# EAGLE board snowmaker_V1.0_for_eagle7.5 (EAGLE 7.7.0), part 1 of 2
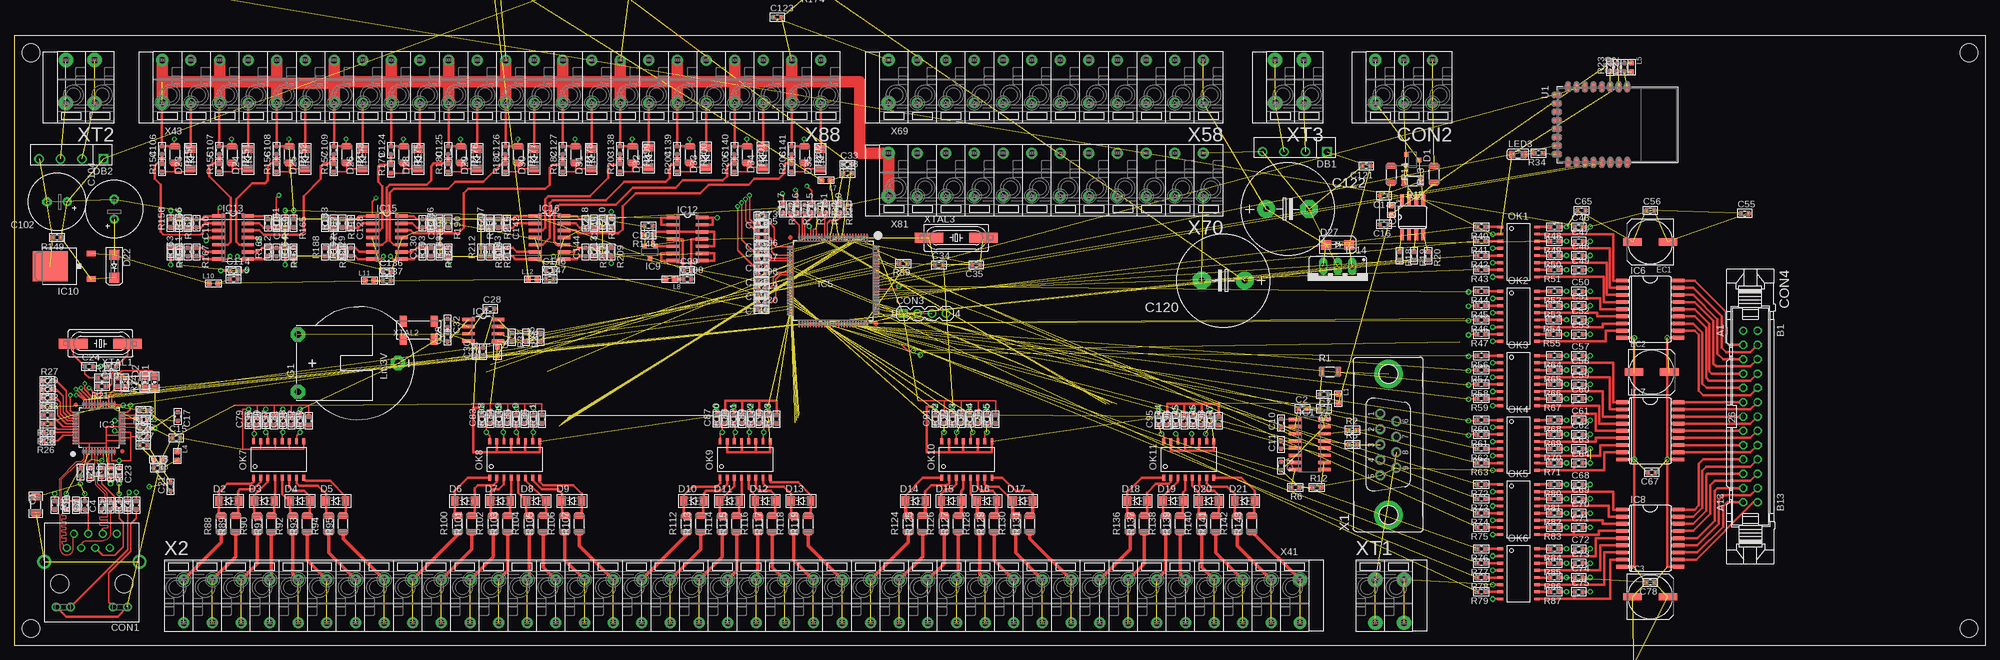
[diagram p11: board, top side]
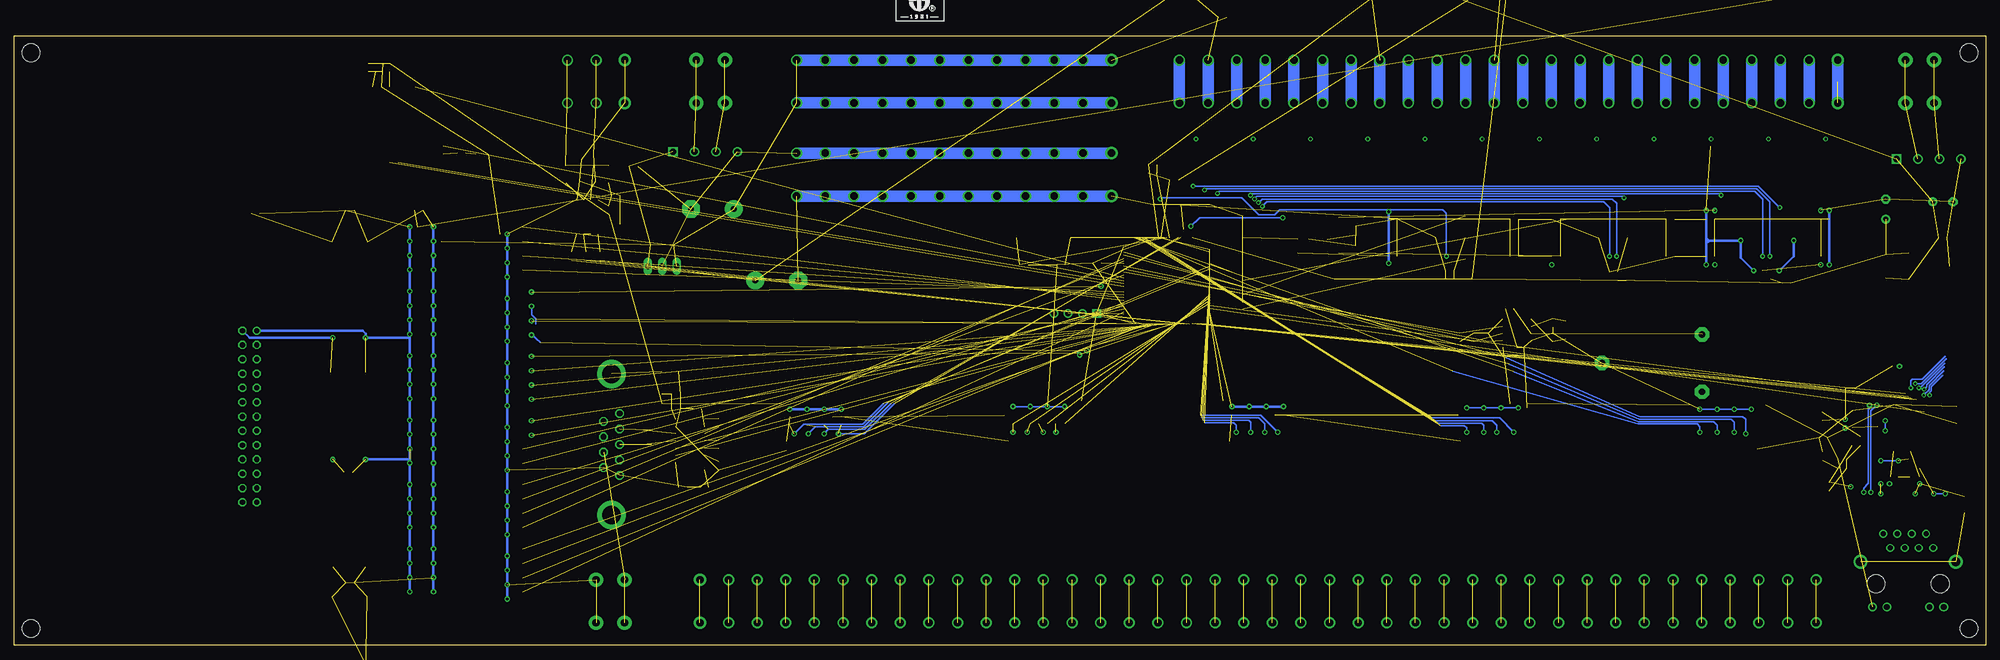
[diagram p12: board, bottom side, seen from below]

Size 350 x 108.2 mm. Coordinates in mm from the lower left corner, seen from the top.
Copper layers (1*16): Top 0.035mm / dielectric 1.5mm / Bottom 0.035mm
Design rules "default *": minimum track width 6mil, minimum drill 0.35mm, track to track 6mil, track to pad 6mil, pad to pad 6mil, via to via 6mil, smd to smd 6mil, copper to edge 40mil, drill to drill 6mil, minimum pad ring 10mil, minimum via ring 8mil, stop-mask expansion 4mil, vias tented up to drill 20mil, thermal gap 10mil

## Footprints (pad centres in the part's own frame; a part is rotated, then mirrored left to right if it is on the bottom)
C1206 = smd 1.21 x 1.82: 1 -1.45,0; 2 1.45,0
C0603 = smd 0.8 x 0.75: 1 -0.75,0; 2 0.75,0
E3,5-10 = drill 0.813 pad 1.6: + -1.778,0 | drill 0.813 pad 1.6 octagon: - 1.778,0
E7,5-16 = drill 1.016 pad 3.15: + -3.81,0 | drill 1.016 pad 3.15 octagon: - 3.81,0
TT5D11 = drill 0.813: + -2.54,0 | drill 0.813 octagon: - 2.54,0
HY951180A = drill 0.89: 1 4.445,-6.35; 2 3.175,-8.89; 3 1.905,-6.35; 4 0.635,-8.89; 5 -0.635,-6.35; 6 -1.905,-8.89; 7 -3.175,-6.35; 8 -4.445,-8.89 | drill 1.02: 9 6.325,4.11; 10 3.785,4.11; 11 -3.785,4.11; 12 -6.325,4.11 | drill 1.63: SS@1 -8.45,-3.9; SS@2 8.45,-3.9 | hole 3.2: -5.715,0; 5.715,0
FFKDS/V1-5.08-3 = drill 1.3: 1@1 0.96,2.77; 1@2 0.96,-4.85; 2@1 6.04,2.77; 2@2 6.04,-4.85 | drill 1.3 pad 2.184: 3@1 11.12,2.77; 3@2 11.12,-4.85
PINHEAD-4P = drill 1.016 square: 1 -3.81,0 | drill 1.016: 2 -1.27,0; 3 1.27,0; 4 3.81,0
26V = drill 0.914: A1 -15.24,-1.27 | drill 0.914 octagon: A2 -12.7,-1.27; A3 -10.16,-1.27; A4 -7.62,-1.27; A5 -5.08,-1.27; A6 -2.54,-1.27; A7 0,-1.27; A8 2.54,-1.27; A9 5.08,-1.27; A10 7.62,-1.27; A11 10.16,-1.27; A12 12.7,-1.27; A13 15.24,-1.27; B1 -15.24,1.27; B2 -12.7,1.27; B3 -10.16,1.27; B4 -7.62,1.27; B5 -5.08,1.27; B6 -2.54,1.27; B7 0,1.27; B8 2.54,1.27; B9 5.08,1.27; B10 7.62,1.27; B11 10.16,1.27; B12 12.7,1.27; B13 15.24,1.27
SOT23-3 = smd 0.78 x 0.78: 1 -0.95,-1.1; 2 0.95,-1.1; 3 0,1.1
MINI_MELF(LL-34) = smd 1.3 x 1.7: A 1.75,0; C -1.75,0
SMA-DO214AC = smd 1.8 x 1.7: A -2.05,0; C 2.05,0
KBP2005 = drill 1.1: AC1 -1.905,0; AC2 1.905,0; DC- 5.715,0 | drill 1.1 square: DC+ -5.715,0
UD-8X10_NICHICON = smd 3.3 x 1.3: + 3.125,0; - -3.125,0
CR2032H = drill 1.118 pad 2.54 octagon: + 5.08,10.795; +@1 -5.08,10.795; - 0,-6.985
SO16 = smd 0.6 x 2.2: 1 -4.445,-2.6; 2 -3.175,-2.6; 3 -1.905,-2.6; 4 -0.635,-2.6; 5 0.635,-2.6; 6 1.905,-2.6; 7 3.175,-2.6; 8 4.445,-2.6; 9 4.445,2.6; 10 3.175,2.6; 11 1.905,2.6; 12 0.635,2.6; 13 -0.635,2.6; 14 -1.905,2.6; 15 -3.175,2.6; 16 -4.445,2.6
SO08 = smd 0.66 x 2.032: 1 -1.905,-3.073; 2 -0.635,-3.073; 3 0.635,-3.073; 4 1.905,-3.073; 5 1.905,3.073; 6 0.635,3.073; 7 -0.635,3.073; 8 -1.905,3.073
LQFP48_7X7_0.5P = smd 0.3 x 1.26: 1 -2.75,-4.13; 2 -2.25,-4.13; 3 -1.75,-4.13; 4 -1.25,-4.13; 5 -0.75,-4.13; 6 -0.25,-4.13; 7 0.25,-4.13; 8 0.75,-4.13; 9 1.25,-4.13; 10 1.75,-4.13; 11 2.25,-4.13; 12 2.75,-4.13; 25 2.75,4.13; 26 2.25,4.13; 27 1.75,4.13; 28 1.25,4.13; 29 0.75,4.13; 30 0.25,4.13; 31 -0.25,4.13; 32 -0.75,4.13; 33 -1.25,4.13; 34 -1.75,4.13; 35 -2.25,4.13; 36 -2.75,4.13 | smd 1.26 x 0.3: 13 4.13,-2.75; 14 4.13,-2.25; 15 4.13,-1.75; 16 4.13,-1.25; 17 4.13,-0.75; 18 4.13,-0.25; 19 4.13,0.25; 20 4.13,0.75; 21 4.13,1.25; 22 4.13,1.75; 23 4.13,2.25; 24 4.13,2.75; 37 -4.13,2.75; 38 -4.13,2.25; 39 -4.13,1.75; 40 -4.13,1.25; 41 -4.13,0.75; 42 -4.13,0.25; 43 -4.13,-0.25; 44 -4.13,-0.75; 45 -4.13,-1.25; 46 -4.13,-1.75; 47 -4.13,-2.25; 48 -4.13,-2.75
SOIC-8 = smd 0.6 x 2.2: 1 -1.905,-2.6; 2 -0.635,-2.6; 3 0.635,-2.6; 4 1.905,-2.6; 5 1.905,2.6; 6 0.635,2.6; 7 -0.635,2.6; 8 -1.905,2.6
LQFP100_14X14MM = smd 0.3 x 1.26: 1 -6,-7.63; 2 -5.5,-7.63; 3 -5,-7.63; 4 -4.5,-7.63; 5 -4,-7.63; 6 -3.5,-7.63; 7 -3,-7.63; 8 -2.5,-7.63; 9 -2,-7.63; 10 -1.5,-7.63; 11 -1,-7.63; 12 -0.5,-7.63; 13 0,-7.63; 14 0.5,-7.63; 15 1,-7.63; 16 1.5,-7.63; 17 2,-7.63; 18 2.5,-7.63; 19 3,-7.63; 20 3.5,-7.63; 21 4,-7.63; 22 4.5,-7.63; 23 5,-7.63; 24 5.5,-7.63; 25 6,-7.63; 51 6,7.63; 52 5.5,7.63; 53 5,7.63; 54 4.5,7.63; 55 4,7.63; 56 3.5,7.63; 57 3,7.63; 58 2.5,7.63; 59 2,7.63; 60 1.5,7.63; 61 1,7.63; 62 0.5,7.63; 63 0,7.63; 64 -0.5,7.63; 65 -1,7.63; 66 -1.5,7.63; 67 -2,7.63; 68 -2.5,7.63; 69 -3,7.63; 70 -3.5,7.63; 71 -4,7.63; 72 -4.5,7.63; 73 -5,7.63; 74 -5.5,7.63; 75 -6,7.63 | smd 1.26 x 0.3: 26 7.63,-6; 27 7.63,-5.5; 28 7.63,-5; 29 7.63,-4.5; 30 7.63,-4; 31 7.63,-3.5; 32 7.63,-3; 33 7.63,-2.5; 34 7.63,-2; 35 7.63,-1.5; 36 7.63,-1; 37 7.63,-0.5; 38 7.63,0; 39 7.63,0.5; 40 7.63,1; 41 7.63,1.5; 42 7.63,2; 43 7.63,2.5; 44 7.63,3; 45 7.63,3.5; 46 7.63,4; 47 7.63,4.5; 48 7.63,5; 49 7.63,5.5; 50 7.63,6; 76 -7.63,6; 77 -7.63,5.5; 78 -7.63,5; 79 -7.63,4.5; 80 -7.63,4; 81 -7.63,3.5; 82 -7.63,3; 83 -7.63,2.5; 84 -7.63,2; 85 -7.63,1.5; 86 -7.63,1; 87 -7.63,0.5; 88 -7.63,0; 89 -7.63,-0.5; 90 -7.63,-1; 91 -7.63,-1.5; 92 -7.63,-2; 93 -7.63,-2.5; 94 -7.63,-3; 95 -7.63,-3.5; 96 -7.63,-4; 97 -7.63,-4.5; 98 -7.63,-5; 99 -7.63,-5.5; 100 -7.63,-6
SO18W = smd 0.66 x 2.032: 1 -5.08,-5.029; 2 -3.81,-5.029; 3 -2.54,-5.029; 4 -1.27,-5.029; 5 0,-5.029; 6 1.27,-5.029; 7 2.54,-5.029; 8 3.81,-5.029; 9 5.08,-5.029; 10 5.08,5.029; 11 3.81,5.029; 12 2.54,5.029; 13 1.27,5.029; 14 0,5.029; 15 -1.27,5.029; 16 -2.54,5.029; 17 -3.81,5.029; 18 -5.08,5.029
TO252 = smd 1 x 1.6: 1 -2.28,-4.8; 2 2.28,-4.8 | smd 5.4 x 6.2: 3 0,2.5
SOIC-14 = smd 0.6 x 2.2: 1 -3.81,-2.6; 2 -2.54,-2.6; 3 -1.27,-2.6; 4 0,-2.6; 5 1.27,-2.6; 6 2.54,-2.6; 7 3.81,-2.6; 8 3.81,2.6; 9 2.54,2.6; 10 1.27,2.6; 11 0,2.6; 12 -1.27,2.6; 13 -2.54,2.6; 14 -3.81,2.6
78XXS = drill 1.016 long: GND 0,-2.54; IN -2.54,-2.54; OUT 2.54,-2.54
L0603 = smd 0.889 x 0.889: 1 -0.762,0; 2 0.762,0
L0805 = smd 1.016 x 1.397: 1 -0.889,0; 2 0.889,0
SML0805 = smd 1.2 x 1.2: A 1.05,0; C -1.05,0
LED0805 = smd 1.15 x 1.3: A 1.125,0; C -1.125,0
MINI-FLAT-16 = smd 1 x 0.5: 1 -3.24,4.445; 2 -3.24,3.175; 3 -3.24,1.905; 4 -3.24,0.635; 5 -3.24,-0.635; 6 -3.24,-1.905; 7 -3.24,-3.175; 8 -3.24,-4.445; 9 3.24,-4.445; 10 3.24,-3.175; 11 3.24,-1.905; 12 3.24,-0.635; 13 3.24,0.635; 14 3.24,1.905; 15 3.24,3.175; 16 3.24,4.445
R1206 = smd 1.05 x 1.77: 1 -1.485,0; 2 1.485,0
R0603 = smd 0.89 x 0.96: 1 -0.755,0; 2 0.755,0
LQ-BTM2540 = smd 1.6 x 0.8: 1 -6.687,1.758; 2 -6.687,0.258; 3 -6.687,-1.242; 4 -6.687,-2.743; 5 -6.687,-4.242; 6 -6.687,-5.742; 7 -6.687,-7.242; 8 -6.687,-8.742; 17 6.713,-8.742; 18 6.713,-7.242; 19 6.713,-5.742; 20 6.713,-4.242; 21 6.713,-2.743; 22 6.713,-1.242; 23 6.713,0.258; 24 6.713,1.758 | smd 0.8 x 1.6: 9 -5.249,-10.742; 10 -3.749,-10.742; 11 -2.249,-10.742; 12 -0.749,-10.742; 13 0.751,-10.742; 14 2.251,-10.742; 15 3.751,-10.742; 16 5.251,-10.742
SNOWMAKER_V1_OUTLINE = hole 3.2: 3,3; 3,105.2; 347,105.2; 347,3
F09VP = drill 1.016 octagon: 1 5.486,1.422; 2 2.743,1.422; 3 0,1.422; 4 -2.743,1.422; 5 -5.486,1.422; 6 4.115,-1.422; 7 1.372,-1.422; 8 -1.372,-1.422; 9 -4.115,-1.422 | drill 3.302 pad 5.08: G1 -12.522,0; G2 12.522,0
FFKDS/V1-5,08-1_FIRST = drill 1.3: 1@1 0.96,2.77; 2@1 0.96,-4.85
FFKDS/V1-5,08-1_MIDDLE = drill 1.3: 1@1 0.96,2.77; 2@1 0.96,-4.85
FFKDS/V1-5,08-1_LAST = drill 1.3 pad 2.184: 1@1 0.96,2.77; 2@1 0.96,-4.85
FFKDS/V1-5.08-2 = drill 1.3 pad 2.54: 1@1 -1.58,2.77; 1@2 -1.58,-4.85; 2@1 3.5,2.77; 2@2 3.5,-4.85
SM49 = smd 5.08 x 1.778: 1 -4.826,0; 2 4.826,0
MC306 = smd 1.3 x 1.9: 1 -2.75,-1.6; 2 2.75,-1.6; 3 2.75,1.6; 4 -2.75,1.6

## Placement (x,y rotation side)
C1  1nF/2kV  [C1206]  3.86,24.97 90 top
C2  100nF/50V  [C0603]  228.69,42.02 0 top
C3  100nF/50V  [C0603]  224.88,31.86 270 top
C4  6.8nF/50V  [C0603]  15.59,24.89 90 top
C5  6.8nF/50V  [C0603]  17.11,24.89 90 top
C6  10nF/50V  [C0603]  18.63,24.89 90 top
C7  10uF/16V  [C0603]  232.5,44.56 180 top
C8  22nF/50V  [C0603]  12.54,24.89 90 top
C9  100nF/50V  [C0603]  232.5,42.02 180 top
C10  100nF/50V  [C0603]  224.88,39.48 90 top
C11  100nF/50V  [C0603]  224.88,35.67 90 top
C12  4.7uF/10V  [C0603]  22.95,38.61 0 top
C13  10nF/50V  [C0603]  22.95,40.13 0 top
C14  100nF/50V  [C0603]  243.16,79.83 180 top
C15  100nF/50V  [C0603]  28.79,36.83 0 top
C16  100nF/50V  [C0603]  243.16,74.75 180 top
C17  100nF/50V  [C0603]  29.05,40.64 270 top
C18  100nF/50V  [C0603]  25.49,31.5 0 top
C19  18pF/50V  [C0603]  17.36,49.53 180 top
C20  10uF/16V  [C0603]  284.57,102.62 90 top
C21  100nF/50V  [C0603]  27.78,28.19 90 top
C22  100nF/50V  [C0603]  285.84,102.62 90 top
C23  100nF/50V  [C0603]  18.63,30.73 270 top
C24  18pF/50V  [C0603]  13.3,49.53 0 top
C25  100nF/50V  [C0603]  11.78,30.73 270 top
C26  100nF/50V  [C0603]  22.95,37.08 0 top
C27  10uF/16V  [C0603]  22.95,35.56 0 top
C28  100nF/50V  [C0603]  84.53,59.77 0 top
C29  6.8pF/50V/NP0  [C0603]  76.91,54.69 90 top
C30  100nF/50V  [C0603]  81.99,52.15 90 top
C31  10uF/16V  [C0603]  83.26,52.15 90 top
C32  6.8pF/50V/NP0  [C0603]  76.91,57.23 270 top
C33  100nF/50V  [C0603]  147.92,85.34 0 top
C34  18pF/50V/NP0  [C0603]  164.18,67.56 0 top
C35  18pF/50V/NP0  [C0603]  170.78,67.56 180 top
C36  100nF/50V  [C0603]  76.8,124.46 0 top  (outside the outline)
C37  100nF/50V  [C0603]  69.18,124.46 0 top  (outside the outline)
C38  100nF/50V  [C0603]  61.56,124.46 0 top  (outside the outline)
C39  100nF/50V  [C0603]  53.94,124.46 0 top  (outside the outline)
C40  100nF/50V  [C0603]  46.32,124.46 0 top  (outside the outline)
C41  100nF/50V  [C0603]  38.7,124.46 0 top  (outside the outline)
C42  100nF/50V  [C0603]  31.08,124.46 0 top  (outside the outline)
C43  100nF/50V  [C0603]  23.46,124.46 0 top  (outside the outline)
C44  100nF/50V  [C0603]  18.38,123.19 0 top  (outside the outline)
C45  100nF/50V  [C0603]  17.11,118.11 0 top  (outside the outline)
C46  10nF/50V  [C0603]  277.71,74.3 0 top
C47  10nF/50V  [C0603]  277.71,71.75 0 top
C48  10nF/50V  [C0603]  277.71,69.22 0 top
C49  10nF/50V  [C0603]  277.71,66.67 0 top
C50  10nF/50V  [C0603]  277.71,62.87 0 top
C51  10nF/50V  [C0603]  277.71,60.33 0 top
C52  10nF/50V  [C0603]  277.71,57.78 0 top
C53  10nF/50V  [C0603]  277.71,55.24 0 top
C54  100nF/50V  [C0603]  300.83,-8.64 0 top  (outside the outline)
C55  100nF/50V  [C0603]  307.18,76.71 0 top
C56  100nF/50V  [C0603]  290.41,77.22 0 top
C57  10nF/50V  [C0603]  277.71,51.44 0 top
C58  10nF/50V  [C0603]  277.71,48.9 0 top
C59  10nF/50V  [C0603]  277.71,46.35 0 top
C60  10nF/50V  [C0603]  277.71,43.81 0 top
C61  10nF/50V  [C0603]  277.71,40.01 0 top
C62  10nF/50V  [C0603]  277.71,37.47 0 top
C63  10nF/50V  [C0603]  277.71,34.92 0 top
C64  10nF/50V  [C0603]  277.71,32.38 0 top
C65  100nF/50V  [C0603]  278.22,77.22 0 top
C66  100nF/50V  [C0603]  283.56,-8.64 0 top  (outside the outline)
C67  100nF/50V  [C0603]  290.67,30.73 180 top
C68  10nF/50V  [C0603]  277.71,28.57 0 top
C69  10nF/50V  [C0603]  277.71,26.04 0 top
C70  10nF/50V  [C0603]  277.71,23.5 0 top
C71  10nF/50V  [C0603]  277.71,20.95 0 top
C72  10nF/50V  [C0603]  277.71,17.14 0 top
C73  10nF/50V  [C0603]  277.71,14.61 0 top
C74  10nF/50V  [C0603]  277.71,12.06 0 top
C75  10nF/50V  [C0603]  277.71,9.53 0 top
C76  100nF/50V  [C0603]  286.86,-6.35 0 top  (outside the outline)
C77  100nF/50V  [C0603]  291.94,-9.4 0 top  (outside the outline)
C78  100nF/50V  [C0603]  290.41,11.18 180 top
C79  10nF/50V  [C0603]  41.62,39.88 90 top
C80  10nF/50V  [C0603]  44.67,39.88 90 top
C81  10nF/50V  [C0603]  47.72,39.88 90 top
C82  10nF/50V  [C0603]  50.77,39.88 90 top
C83  10nF/50V  [C0603]  83.02,40.13 90 top
C84  10nF/50V  [C0603]  86.07,40.13 90 top
C85  10nF/50V  [C0603]  89.12,40.13 90 top
C86  10nF/50V  [C0603]  92.17,40.13 90 top
C87  10nF/50V  [C0603]  124.68,40.13 90 top
C88  10nF/50V  [C0603]  127.73,40.13 90 top
C89  10nF/50V  [C0603]  130.78,40.13 90 top
C90  10nF/50V  [C0603]  133.82,40.13 90 top
C91  10nF/50V  [C0603]  163.54,40.13 90 top
C92  10nF/50V  [C0603]  166.59,40.13 90 top
C93  10nF/50V  [C0603]  169.64,40.13 90 top
C94  10nF/50V  [C0603]  172.69,40.13 90 top
C95  10nF/50V  [C0603]  203.16,39.88 90 top
C96  10nF/50V  [C0603]  206.21,39.88 90 top
C97  10nF/50V  [C0603]  209.26,39.88 90 top
C98  10nF/50V  [C0603]  212.31,39.88 90 top
C99  100nF/50V  [C0603]  119.47,66.55 0 top
C100  10uF/16V  [C0603]  119.47,65.02 0 top
C101  100nF/50V  [C0603]  112.61,74.42 180 top
C102  1000uF/16V_M10*16  [E3,5-10]  7.62,78.74 180 top
C103  100nF/50V  [C0603]  133.95,129.54 0 top  (outside the outline)
C104  220uF/16V_M10*16  [E3,5-10]  17.78,77.47 90 top
C105  100nF/50V  [C0603]  84.42,128.27 0 top  (outside the outline)
C106  100nF/50V  [C0603]  26.25,87.88 90 top
C107  100nF/50V  [C0603]  36.41,87.88 90 top
C108  100nF/50V  [C0603]  46.57,87.88 90 top
C109  100nF/50V  [C0603]  56.73,87.88 90 top
C110  30pF/50V  [C0603]  32.35,74.93 270 top
C111  30pF/50V  [C0603]  30.83,69.85 90 top
C112  30pF/50V  [C0603]  46.57,69.85 90 top
C113  30pF/50V  [C0603]  45.05,74.93 270 top
C114  100nF/50V  [C0603]  38.95,66.55 0 top
C115  1nF/50V  [C0603]  142.84,77.47 90 top
C116  1nF/50V  [C0603]  140.3,77.47 90 top
C117  1nF/50V  [C0603]  137.76,77.47 90 top
C118  1nF/50V  [C0603]  132.68,76.2 180 top
C119  10uF/16V  [C0603]  38.95,65.02 0 top
C120  2200uF/50V_M16*25  [E7,5-16]  214.63,64.77 180 top
C121  100nF/50V  [C0603]  240.03,85.09 180 top
C122  1000uF/50V_M16*25  [E7,5-16]  226.06,77.47 0 top
C123  100nF/50V  [C0603]  135.47,111.51 0 top  (outside the outline)
C124  100nF/50V  [C0603]  66.89,87.88 90 top
C125  100nF/50V  [C0603]  77.05,87.88 90 top
C126  100nF/50V  [C0603]  87.21,87.88 90 top
C127  100nF/50V  [C0603]  97.37,87.88 90 top
C128  30pF/50V  [C0603]  59.78,74.93 270 top
C129  30pF/50V  [C0603]  59.78,69.85 90 top
C130  30pF/50V  [C0603]  72.48,69.85 90 top
C131  30pF/50V  [C0603]  72.48,74.93 270 top
C132  1nF/50V  [C0603]  132.68,72.39 180 top
C133  1nF/50V  [C0603]  132.68,71.12 180 top
C134  1nF/50V  [C0603]  132.68,68.58 180 top
C135  1nF/50V  [C0603]  132.68,66.04 180 top
C136  100nF/50V  [C0603]  66.13,66.29 0 top
C137  10uF/16V  [C0603]  66.13,64.77 0 top
C138  100nF/50V  [C0603]  107.53,87.88 90 top
C139  100nF/50V  [C0603]  117.69,87.88 90 top
C140  100nF/50V  [C0603]  127.85,87.88 90 top
C141  100nF/50V  [C0603]  138.01,87.88 90 top
C142  30pF/50V  [C0603]  87.47,74.93 270 top
C143  30pF/50V  [C0603]  87.47,69.85 90 top
C144  30pF/50V  [C0603]  101.44,69.85 90 top
C145  30pF/50V  [C0603]  101.44,74.93 270 top
C146  100nF/50V  [C0603]  95.09,66.55 0 top
C147  10uF/16V  [C0603]  95.09,65.02 0 top
C148  1nF/50V  [C0603]  132.68,63.5 180 top
C149  1nF/50V  [C0603]  132.68,60.96 180 top
C150  1nF/50V  [C0603]  147.92,77.47 90 top
C151  1nF/50V  [C0603]  145.38,77.47 90 top
C152  [TT5D11]  156.21,120.65 0 top  (outside the outline)
C153  [TT5D11]  173.99,121.92 0 top  (outside the outline)
CON1  HR951180A  [HY951180A]  13.8,10.95 180 top
CON2  FFKDS/V1-5.08-3  [FFKDS/V1-5.08-3]  252.73,99.06 180 top
CON3  SWJ  [PINHEAD-4P]  161.64,58.93 0 top
CON4  [26V]  308.19,40.64 270 top
D1  SM712-02H  [SOT23-3]  248.24,86.18 270 top
D2  1N4148  [MINI_MELF(LL-34)]  38.06,25.65 0 top
D3  1N4148  [MINI_MELF(LL-34)]  44.41,25.65 0 top
D4  1N4148  [MINI_MELF(LL-34)]  50.77,25.65 0 top
D5  1N4148  [MINI_MELF(LL-34)]  57.12,25.65 0 top
D6  1N4148  [MINI_MELF(LL-34)]  79.97,25.65 0 top
D7  1N4148  [MINI_MELF(LL-34)]  86.33,25.65 0 top
D8  1N4148  [MINI_MELF(LL-34)]  92.67,25.65 0 top
D9  1N4148  [MINI_MELF(LL-34)]  99.03,25.65 0 top
D10  1N4148  [MINI_MELF(LL-34)]  120.61,25.65 0 top
D11  1N4148  [MINI_MELF(LL-34)]  126.97,25.65 0 top
D12  1N4148  [MINI_MELF(LL-34)]  133.31,25.65 0 top
D13  1N4148  [MINI_MELF(LL-34)]  139.66,25.65 0 top
D14  1N4148  [MINI_MELF(LL-34)]  159.99,25.65 0 top
D15  1N4148  [MINI_MELF(LL-34)]  166.34,25.65 0 top
D16  1N4148  [MINI_MELF(LL-34)]  172.69,25.65 0 top
D17  1N4148  [MINI_MELF(LL-34)]  179.03,25.65 0 top
D18  1N4148  [MINI_MELF(LL-34)]  199.35,25.65 0 top
D19  1N4148  [MINI_MELF(LL-34)]  205.71,25.65 0 top
D20  1N4148  [MINI_MELF(LL-34)]  212.06,25.65 0 top
D21  1N4148  [MINI_MELF(LL-34)]  218.41,25.65 0 top
D22  1N4007  [SMA-DO214AC]  17.78,67.31 270 top
D23  1N4148  [MINI_MELF(LL-34)]  31.33,86.36 90 top
D24  1N4148  [MINI_MELF(LL-34)]  41.49,86.36 90 top
D25  1N4148  [MINI_MELF(LL-34)]  51.65,86.36 90 top
D26  1N4148  [MINI_MELF(LL-34)]  61.81,86.36 90 top
D27  1N4007  [SMA-DO214AC]  234.95,71.12 0 top
D28  1N4148  [MINI_MELF(LL-34)]  71.72,86.36 90 top
D29  1N4148  [MINI_MELF(LL-34)]  82.13,86.36 90 top
D30  1N4148  [MINI_MELF(LL-34)]  92.29,86.36 90 top
D31  1N4148  [MINI_MELF(LL-34)]  102.45,86.36 90 top
D32  1N4148  [MINI_MELF(LL-34)]  112.61,86.61 90 top
D33  1N4148  [MINI_MELF(LL-34)]  122.77,86.61 90 top
D34  1N4148  [MINI_MELF(LL-34)]  132.93,86.61 90 top
D35  1N4148  [MINI_MELF(LL-34)]  143.09,86.36 90 top
DB1  KBP2005G  [KBP2005]  227.33,87.63 180 top
DB2  KBP2005G  [KBP2005]  10.16,86.36 180 top
EC1  220uF/50V  [UD-8X10_NICHICON]  290.41,71.63 180 top
EC2  220uF/50V  [UD-8X10_NICHICON]  290.67,48.51 0 top
EC3  220uF/50V  [UD-8X10_NICHICON]  290.41,8.64 0 top
G1  CR2032H  [CR2032H]  61.16,50.12 90 top
IC1  ST3232BD  [SO16]  229.97,35.67 270 top
IC2  ST3485EBD  [SO08]  248.24,76.02 0 top
IC3  W5500  [LQFP48_7X7_0.5P]  15.08,38.61 0 top
IC4  SD2068  [SOIC-8]  83.26,55.96 270 top
IC5  STM32F103VCT6  [LQFP100_14X14MM]  145.38,64.77 180 top
IC6  ULN2803  [SO18W]  290.41,59.69 270 top
IC7  ULN2803  [SO18W]  290.41,38.1 270 top
IC8  ULN2803  [SO18W]  290.41,19.05 270 top
IC9  LM4040AIM3X-2.5  [SOT23-3]  112.87,69.85 180 top
IC10  LM1117IDTX-3.3  [TO252]  8.89,67.31 90 top
IC12  SGM8584XS14  [SOIC-14]  119.54,72.14 270 top
IC13  SGM8584XS14  [SOIC-14]  38.87,72.39 270 top
IC14  LM78M24  [78XXS]  234.95,64.77 180 top
IC15  SGM8584XS14  [SOIC-14]  66.18,72.39 270 top
IC16  SGM8584XS14  [SOIC-14]  95.02,72.39 270 top
L1  600R/100MHz  [L0603]  235.04,43.8 270 top
L2  600R/100MHz  [L0603]  244.43,77.29 270 top
L3  120R/100MHz 3A  [L0603]  25.49,33.02 180 top
L4  120R/100MHz 3A  [L0603]  28.96,33.62 270 top
L5  600R/100MHz  [L0603]  287.11,102.62 270 top
L6  600R/100MHz  [L0603]  85.8,52.15 270 top
L7  600R/100MHz  [L0603]  144.11,82.55 180 top
L8  10uH  [L0603]  116.42,65.02 180 top
L9  120R/100MHz 3A  [L0805]  108.33,116.25 0 top  (outside the outline)
L10  10uH  [L0603]  35.4,64.26 0 top
L11  10uH  [L0603]  63.08,64.77 0 top
L12  10uH  [L0603]  92.04,65.02 0 top
LED1  [SML0805]  24.94,46.7 90 top
LED2  [SML0805]  23.16,46.7 90 top
LED3  [LED0805]  266.94,87.17 0 top
LOGO1  SY-LOGO_BOTTOM  [SY-LOGO_BOTTOM]  189.19,114.3 0 top  (outside the outline)
OK1  TLP283-4  [MINI-FLAT-16]  267.05,69.85 0 top
OK2  TLP283-4  [MINI-FLAT-16]  267.05,58.42 0 top
OK3  TLP283-4  [MINI-FLAT-16]  267.05,46.99 0 top
OK4  TLP283-4  [MINI-FLAT-16]  267.05,35.56 0 top
OK5  TLP283-4  [MINI-FLAT-16]  267.05,24.13 0 top
OK6  TLP283-4  [MINI-FLAT-16]  267.05,12.7 0 top
OK7  TLP283-4  [MINI-FLAT-16]  46.95,33.02 90 top
OK8  TLP283-4  [MINI-FLAT-16]  88.86,33.02 90 top
OK9  TLP283-4  [MINI-FLAT-16]  129.76,33.02 90 top
OK10  TLP283-4  [MINI-FLAT-16]  169.13,33.02 90 top
OK11  TLP283-4  [MINI-FLAT-16]  208.5,33.02 90 top
R1  0R  [R1206]  233.56,48.6 0 top
R2  22R  [R0603]  237.59,38.21 0 top
R3  330R  [R0603]  20.16,24.89 90 top
R4  330R  [R0603]  21.68,24.89 90 top
R5  22R  [R0603]  237.59,35.67 0 top
R6  10k  [R0603]  227.43,28.05 180 top
R7  49R9  [R0603]  9.24,24.89 270 top
R8  49R9  [R0603]  7.2,24.89 270 top
R9  49R9  [R0603]  13.55,30.73 270 top
R10  10R  [R0603]  11.01,24.89 90 top
R11  49R9  [R0603]  15.59,30.73 270 top
R12  10k  [R0603]  231.24,28.05 0 top
R13  120R  [R1206]  252.05,83.64 90 top
R14  2.4k  [R1206]  244.43,83.64 270 top
R15  2.4k  [R1206]  248.24,82.37 180 top
R16  12.4k/1%  [R0603]  17.11,30.73 270 top
R17  10k  [R0603]  22.95,41.66 180 top
R18  0R  [R0603]  245.93,69.16 270 top
R19  0R  [R0603]  248.47,69.16 270 top
R20  0R  [R0603]  251.01,69.16 270 top
R21  1M  [R0603]  15.59,45.97 180 top
R22  0R  [R0603]  15.59,47.5 0 top
R23  10k  [R0603]  283.3,102.62 90 top
R24  330R  [R0603]  19.65,46.74 270 top
R25  330R  [R0603]  18.38,46.74 270 top
R26  10k  [R0603]  5.93,36.32 180 top
R27  10k  [R0603]  5.93,46.99 0 top
R28  10k  [R0603]  5.93,37.85 180 top
R29  10k  [R0603]  5.93,45.47 0 top
R30  10k  [R0603]  5.93,39.37 180 top
R31  10k  [R0603]  5.93,43.94 0 top
R32  10k  [R0603]  5.93,42.42 0 top
R33  10k  [R0603]  5.93,40.89 0 top
R34  1k  [R0603]  270.6,87.38 180 top
R35  10k  [R0603]  93.42,54.69 90 top
R36  10k  [R0603]  90.88,54.69 270 top
R37  10k  [R0603]  88.34,54.69 270 top
R38  10k  [R0603]  147.92,83.82 0 top
R39  10k  [R0603]  157.83,67.82 180 top
R40  330R  [R0603]  260.44,74.3 180 top
R41  330R  [R0603]  260.44,71.75 180 top
R42  330R  [R0603]  260.44,69.22 180 top
R43  330R  [R0603]  260.44,66.67 180 top
R44  330R  [R0603]  260.44,62.87 180 top
R45  330R  [R0603]  260.44,60.33 180 top
R46  330R  [R0603]  260.44,57.78 180 top
R47  330R  [R0603]  260.44,55.24 180 top
R48  20K  [R0603]  273.4,74.3 180 top
R49  20K  [R0603]  273.4,71.75 180 top
R50  20K  [R0603]  273.4,69.22 180 top
R51  20K  [R0603]  273.4,66.67 180 top
R52  20K  [R0603]  273.4,62.87 180 top
R53  20K  [R0603]  273.4,60.33 180 top
R54  20K  [R0603]  273.27,57.78 180 top
R55  20K  [R0603]  273.27,55.24 180 top
R56  330R  [R0603]  260.44,51.44 180 top
R57  330R  [R0603]  260.44,48.9 180 top
R58  330R  [R0603]  260.44,46.35 180 top
R59  330R  [R0603]  260.44,43.81 180 top
R60  330R  [R0603]  260.44,40.01 180 top
R61  330R  [R0603]  260.44,37.47 180 top
R62  330R  [R0603]  260.44,34.92 180 top
R63  330R  [R0603]  260.44,32.38 180 top
R64  20K  [R0603]  273.4,51.44 180 top
R65  20K  [R0603]  273.4,48.9 180 top
R66  20K  [R0603]  273.4,46.35 180 top
R67  20K  [R0603]  273.4,43.81 180 top
R68  20K  [R0603]  273.4,40.01 180 top
R69  20K  [R0603]  273.4,37.47 180 top
R70  20K  [R0603]  273.4,34.92 180 top
R71  20K  [R0603]  273.4,32.38 180 top
R72  330R  [R0603]  260.44,28.57 180 top
R73  330R  [R0603]  260.44,26.04 180 top
R74  330R  [R0603]  260.44,23.5 180 top
R75  330R  [R0603]  260.44,20.95 180 top
R76  330R  [R0603]  260.44,17.14 180 top
R77  330R  [R0603]  260.44,14.61 180 top
R78  330R  [R0603]  260.44,12.06 180 top
R79  330R  [R0603]  260.44,9.53 180 top
R80  20K  [R0603]  273.4,28.57 180 top
R81  20K  [R0603]  273.4,26.04 180 top
R82  20K  [R0603]  273.4,23.5 180 top
R83  20K  [R0603]  273.4,20.95 180 top
R84  20K  [R0603]  273.4,17.14 180 top
R85  20K  [R0603]  273.4,14.61 180 top
R86  20K  [R0603]  273.4,12.06 180 top
R87  20K  [R0603]  273.4,9.53 180 top
R88  2.2k  [R1206]  36.8,21.59 90 top
R89  2.2k  [R1206]  39.34,21.59 90 top
R90  2.2k  [R1206]  43.15,21.59 90 top
R91  2.2k  [R1206]  45.69,21.59 90 top
R92  2.2k  [R1206]  49.49,21.59 90 top
R93  2.2k  [R1206]  52.03,21.59 90 top
R94  2.2k  [R1206]  55.84,21.59 90 top
R95  2.2k  [R1206]  58.38,21.59 90 top
R96  10K  [R0603]  43.15,39.88 90 top
R97  10K  [R0603]  46.19,39.88 90 top
R98  10K  [R0603]  49.24,39.88 90 top
R99  10K  [R0603]  52.29,39.88 90 top
R100  2.2k  [R1206]  78.7,21.59 90 top
R101  2.2k  [R1206]  81.25,21.59 90 top
R102  2.2k  [R1206]  85.06,21.59 90 top
R103  2.2k  [R1206]  87.59,21.59 90 top
R104  2.2k  [R1206]  91.41,21.59 90 top
R105  2.2k  [R1206]  93.94,21.59 90 top
R106  2.2k  [R1206]  97.75,21.59 90 top
R107  2.2k  [R1206]  100.3,21.59 90 top
R108  10K  [R0603]  84.55,40.13 90 top
R109  10K  [R0603]  87.59,40.13 90 top
R110  10K  [R0603]  90.64,40.13 90 top
R111  10K  [R0603]  93.69,40.13 90 top
R112  2.2k  [R1206]  119.34,21.59 90 top
R113  2.2k  [R1206]  121.89,21.59 90 top
R114  2.2k  [R1206]  125.69,21.59 90 top
R115  2.2k  [R1206]  128.24,21.59 90 top
R116  2.2k  [R1206]  132.04,21.59 90 top
R117  2.2k  [R1206]  134.59,21.59 90 top
R118  2.2k  [R1206]  138.4,21.59 90 top
R119  2.2k  [R1206]  140.94,21.59 90 top
R120  10K  [R0603]  126.2,40.13 90 top
R121  10K  [R0603]  129.25,40.13 90 top
R122  10K  [R0603]  132.3,40.13 90 top
R123  10K  [R0603]  135.35,40.13 90 top
R124  2.2k  [R1206]  158.72,21.59 90 top
R125  2.2k  [R1206]  161.25,21.59 90 top
R126  2.2k  [R1206]  165.06,21.59 90 top
R127  2.2k  [R1206]  167.6,21.59 90 top
R128  2.2k  [R1206]  171.41,21.59 90 top
R129  2.2k  [R1206]  173.96,21.59 90 top
R130  2.2k  [R1206]  177.76,21.59 90 top
R131  2.2k  [R1206]  180.31,21.59 90 top
R132  10K  [R0603]  165.06,40.13 90 top
R133  10K  [R0603]  168.11,40.13 90 top
R134  10K  [R0603]  171.16,40.13 90 top
R135  10K  [R0603]  174.21,40.13 90 top
R136  2.2k  [R1206]  198.09,21.59 90 top
R137  2.2k  [R1206]  200.62,21.59 90 top
R138  2.2k  [R1206]  204.44,21.59 90 top
R139  2.2k  [R1206]  206.97,21.59 90 top
R140  2.2k  [R1206]  210.78,21.59 90 top
R141  2.2k  [R1206]  213.32,21.59 90 top
R142  2.2k  [R1206]  217.13,21.59 90 top
R143  2.2k  [R1206]  219.68,21.59 90 top
R144  10K  [R0603]  204.69,39.88 90 top
R145  10K  [R0603]  207.74,39.88 90 top
R146  10K  [R0603]  210.78,39.88 90 top
R147  10K  [R0603]  213.83,39.88 90 top
R148  10k  [R0603]  112.61,72.9 180 top
R149  10K  [R0603]  7.62,72.39 180 top
R150  120R/0.1%  [R1206]  28.54,87.12 270 top
R151  120R/0.1%  [R1206]  38.7,87.12 270 top
R152  120R/0.1%  [R1206]  48.86,87.12 270 top
R153  120R/0.1%  [R1206]  59.02,87.12 270 top
R154  10k  [R0603]  26.25,84.84 90 top
R155  10k  [R0603]  36.41,84.84 90 top
R156  10k  [R0603]  46.57,84.84 90 top
R157  10k  [R0603]  56.73,84.84 90 top
R158  5.11k/1%  [R0603]  27.78,74.93 90 top
R159  5.11k/1%  [R0603]  27.78,69.85 270 top
R160  5.11k/1%  [R0603]  48.1,69.85 270 top
R161  5.11k/1%  [R0603]  48.1,74.93 90 top
R162  124k/1%  [R0603]  29.3,74.93 270 top
R163  124k/1%  [R0603]  29.3,69.85 90 top
R164  124k/1%  [R0603]  49.62,69.85 90 top
R165  124k/1%  [R0603]  49.62,74.93 270 top
R166  1k/1%  [R0603]  30.83,74.93 90 top
R167  1k/1%  [R0603]  32.35,69.85 270 top
R168  1k/1%  [R0603]  45.05,69.85 90 top
R169  1k/1%  [R0603]  46.57,74.93 270 top
R170  1k  [R0603]  141.57,77.47 270 top
R171  1k  [R0603]  139.03,77.47 270 top
R172  1k  [R0603]  136.49,77.47 270 top
R173  1k  [R0603]  132.68,74.93 0 top
R174  20K  [R0603]  142.59,116.33 180 top  (outside the outline)
R175  120R/0.1%  [R1206]  69.18,87.12 270 top
R176  120R/0.1%  [R1206]  79.34,87.12 270 top
R177  120R/0.1%  [R1206]  89.5,87.12 270 top
R178  120R/0.1%  [R1206]  99.66,87.12 270 top
R179  10k  [R0603]  66.89,84.58 90 top
R180  10k  [R0603]  77.05,84.84 90 top
R181  10k  [R0603]  87.21,84.84 90 top
R182  10k  [R0603]  97.37,84.84 90 top
R183  5.11k/1%  [R0603]  56.73,74.93 90 top
R184  5.11k/1%  [R0603]  56.73,69.85 270 top
R185  5.11k/1%  [R0603]  75.53,69.85 270 top
R186  5.11k/1%  [R0603]  75.53,74.93 90 top
R187  124k/1%  [R0603]  55.21,74.93 270 top
R188  124k/1%  [R0603]  55.21,69.85 90 top
R189  124k/1%  [R0603]  77.05,69.85 90 top
R190  124k/1%  [R0603]  77.05,74.93 270 top
R191  1k/1%  [R0603]  58.26,74.93 270 top
R192  1k/1%  [R0603]  58.26,69.85 90 top
R193  1k/1%  [R0603]  74.01,69.85 90 top
R194  1k/1%  [R0603]  74.01,74.93 270 top
R195  1k  [R0603]  132.68,73.66 0 top
R196  1k  [R0603]  132.68,69.85 0 top
R197  1k  [R0603]  132.68,67.31 0 top
R198  1k  [R0603]  132.68,64.77 0 top
R199  120R/0.1%  [R1206]  109.82,87.12 270 top
R200  120R/0.1%  [R1206]  119.98,87.12 270 top
R201  120R/0.1%  [R1206]  130.14,87.12 270 top
R202  120R/0.1%  [R1206]  140.3,87.12 270 top
R203  10k  [R0603]  107.53,84.84 90 top
R204  10k  [R0603]  117.69,84.84 90 top
R205  10k  [R0603]  127.85,84.84 90 top
R206  10k  [R0603]  138.01,84.84 90 top
R207  5.11k/1%  [R0603]  84.42,74.93 90 top
R208  5.11k/1%  [R0603]  84.42,69.85 270 top
R209  5.11k/1%  [R0603]  106.01,69.85 270 top
R210  5.11k/1%  [R0603]  106.01,74.93 90 top
R211  124k/1%  [R0603]  82.9,74.93 270 top
R212  124k/1%  [R0603]  82.9,69.85 90 top
R213  124k/1%  [R0603]  104.49,69.85 90 top
R214  124k/1%  [R0603]  104.49,74.93 270 top
R215  1k/1%  [R0603]  85.94,74.93 270 top
R216  1k/1%  [R0603]  85.94,69.85 270 top
R217  1k/1%  [R0603]  102.96,69.85 270 top
R218  1k/1%  [R0603]  102.96,74.93 90 top
R219  1k  [R0603]  132.68,62.23 0 top
R220  1k  [R0603]  132.68,59.69 0 top
R221  1k  [R0603]  146.65,77.47 270 top
R222  1k  [R0603]  144.11,77.47 270 top
U1  LQ-BTM2540  [LQ-BTM2540]  284.57,92.46 270 top
U$1  [SNOWMAKER_V1_OUTLINE]  0,0 0 top
X1  [F09VP]  243.94,35.67 90 top
X2  FFKDS/V1-5.08_FIRST  [FFKDS/V1-5,08-1_FIRST]  29.18,8.89 0 top
X3  FFKDS/V1-5.08_MIDDLE  [FFKDS/V1-5,08-1_MIDDLE]  34.26,8.89 0 top
X4  FFKDS/V1-5.08_MIDDLE  [FFKDS/V1-5,08-1_MIDDLE]  39.34,8.89 0 top
X5  FFKDS/V1-5.08_MIDDLE  [FFKDS/V1-5,08-1_MIDDLE]  44.41,8.89 0 top
X6  FFKDS/V1-5.08_MIDDLE  [FFKDS/V1-5,08-1_MIDDLE]  49.49,8.89 0 top
X7  FFKDS/V1-5.08_MIDDLE  [FFKDS/V1-5,08-1_MIDDLE]  54.58,8.89 0 top
X8  FFKDS/V1-5.08_MIDDLE  [FFKDS/V1-5,08-1_MIDDLE]  59.66,8.89 0 top
X9  FFKDS/V1-5.08_MIDDLE  [FFKDS/V1-5,08-1_MIDDLE]  64.73,8.89 0 top
X10  FFKDS/V1-5.08_MIDDLE  [FFKDS/V1-5,08-1_MIDDLE]  69.81,8.89 0 top
X11  FFKDS/V1-5.08_MIDDLE  [FFKDS/V1-5,08-1_MIDDLE]  74.89,8.89 0 top
X12  FFKDS/V1-5.08_MIDDLE  [FFKDS/V1-5,08-1_MIDDLE]  79.97,8.89 0 top
X13  FFKDS/V1-5.08_MIDDLE  [FFKDS/V1-5,08-1_MIDDLE]  85.06,8.89 0 top
X14  FFKDS/V1-5.08_MIDDLE  [FFKDS/V1-5,08-1_MIDDLE]  90.14,8.89 0 top
X15  FFKDS/V1-5.08_MIDDLE  [FFKDS/V1-5,08-1_MIDDLE]  95.22,8.89 0 top
X16  FFKDS/V1-5.08_MIDDLE  [FFKDS/V1-5,08-1_MIDDLE]  100.3,8.89 0 top
X17  FFKDS/V1-5.08_MIDDLE  [FFKDS/V1-5,08-1_MIDDLE]  105.38,8.89 0 top
X18  FFKDS/V1-5.08_MIDDLE  [FFKDS/V1-5,08-1_MIDDLE]  110.45,8.89 0 top
X19  FFKDS/V1-5.08_MIDDLE  [FFKDS/V1-5,08-1_MIDDLE]  115.53,8.89 0 top
X20  FFKDS/V1-5.08_MIDDLE  [FFKDS/V1-5,08-1_MIDDLE]  120.61,8.89 0 top
X21  FFKDS/V1-5.08_MIDDLE  [FFKDS/V1-5,08-1_MIDDLE]  125.69,8.89 0 top
X22  FFKDS/V1-5.08_MIDDLE  [FFKDS/V1-5,08-1_MIDDLE]  130.78,8.89 0 top
X23  FFKDS/V1-5.08_MIDDLE  [FFKDS/V1-5,08-1_MIDDLE]  135.85,8.89 0 top
X24  FFKDS/V1-5.08_MIDDLE  [FFKDS/V1-5,08-1_MIDDLE]  140.94,8.89 0 top
X25  FFKDS/V1-5.08_MIDDLE  [FFKDS/V1-5,08-1_MIDDLE]  146.01,8.89 0 top
X26  FFKDS/V1-5.08_MIDDLE  [FFKDS/V1-5,08-1_MIDDLE]  151.09,8.89 0 top
X27  FFKDS/V1-5.08_MIDDLE  [FFKDS/V1-5,08-1_MIDDLE]  156.18,8.89 0 top
X28  FFKDS/V1-5.08_MIDDLE  [FFKDS/V1-5,08-1_MIDDLE]  161.25,8.89 0 top
X29  FFKDS/V1-5.08_MIDDLE  [FFKDS/V1-5,08-1_MIDDLE]  166.34,8.89 0 top
X30  FFKDS/V1-5.08_MIDDLE  [FFKDS/V1-5,08-1_MIDDLE]  171.41,8.89 0 top
X31  FFKDS/V1-5.08_MIDDLE  [FFKDS/V1-5,08-1_MIDDLE]  176.5,8.89 0 top
X32  FFKDS/V1-5.08_MIDDLE  [FFKDS/V1-5,08-1_MIDDLE]  181.57,8.89 0 top
X33  FFKDS/V1-5.08_MIDDLE  [FFKDS/V1-5,08-1_MIDDLE]  186.66,8.89 0 top
X34  FFKDS/V1-5.08_MIDDLE  [FFKDS/V1-5,08-1_MIDDLE]  191.74,8.89 0 top
X35  FFKDS/V1-5.08_MIDDLE  [FFKDS/V1-5,08-1_MIDDLE]  196.81,8.89 0 top
X36  FFKDS/V1-5.08_MIDDLE  [FFKDS/V1-5,08-1_MIDDLE]  201.9,8.89 0 top
X37  FFKDS/V1-5.08_MIDDLE  [FFKDS/V1-5,08-1_MIDDLE]  206.97,8.89 0 top
X38  FFKDS/V1-5.08_MIDDLE  [FFKDS/V1-5,08-1_MIDDLE]  212.06,8.89 0 top
X39  FFKDS/V1-5.08_MIDDLE  [FFKDS/V1-5,08-1_MIDDLE]  217.13,8.89 0 top
X40  FFKDS/V1-5.08_MIDDLE  [FFKDS/V1-5,08-1_MIDDLE]  222.22,8.89 0 top
X41  FFKDS/V1-5.08_LAST  [FFKDS/V1-5,08-1_LAST]  227.29,8.89 0 top
X42  FFKDS/V1-5.08_MIDDLE  [FFKDS/V1-5,08-1_MIDDLE]  32.35,99.06 180 top
X43  FFKDS/V1-5.08_LAST  [FFKDS/V1-5,08-1_LAST]  27.27,99.06 180 top
X44  FFKDS/V1-5.08_MIDDLE  [FFKDS/V1-5,08-1_MIDDLE]  42.51,99.06 180 top
X45  FFKDS/V1-5.08_MIDDLE  [FFKDS/V1-5,08-1_MIDDLE]  37.43,99.06 180 top
X46  FFKDS/V1-5.08_MIDDLE  [FFKDS/V1-5,08-1_MIDDLE]  52.67,99.06 180 top
X47  FFKDS/V1-5.08_MIDDLE  [FFKDS/V1-5,08-1_MIDDLE]  47.59,99.06 180 top
X48  FFKDS/V1-5.08_MIDDLE  [FFKDS/V1-5,08-1_MIDDLE]  62.83,99.06 180 top
X49  FFKDS/V1-5.08_MIDDLE  [FFKDS/V1-5,08-1_MIDDLE]  57.75,99.06 180 top
X50  FFKDS/V1-5.08_MIDDLE  [FFKDS/V1-5,08-1_MIDDLE]  72.99,99.06 180 top
X51  FFKDS/V1-5.08_MIDDLE  [FFKDS/V1-5,08-1_MIDDLE]  67.91,99.06 180 top
X52  FFKDS/V1-5.08_MIDDLE  [FFKDS/V1-5,08-1_MIDDLE]  83.15,99.06 180 top
X53  FFKDS/V1-5.08_MIDDLE  [FFKDS/V1-5,08-1_MIDDLE]  78.07,99.06 180 top
X54  FFKDS/V1-5.08_MIDDLE  [FFKDS/V1-5,08-1_MIDDLE]  93.31,99.06 180 top
X55  FFKDS/V1-5.08_MIDDLE  [FFKDS/V1-5,08-1_MIDDLE]  88.23,99.06 180 top
X56  FFKDS/V1-5.08_MIDDLE  [FFKDS/V1-5,08-1_MIDDLE]  103.47,99.06 180 top
X57  FFKDS/V1-5.08_MIDDLE  [FFKDS/V1-5,08-1_MIDDLE]  98.39,99.06 180 top
X58  FFKDS/V1-5.08_FIRST  [FFKDS/V1-5,08-1_FIRST]  212.06,99.06 180 top
X59  FFKDS/V1-5.08_MIDDLE  [FFKDS/V1-5,08-1_MIDDLE]  206.97,99.06 180 top
X60  FFKDS/V1-5.08_MIDDLE  [FFKDS/V1-5,08-1_MIDDLE]  201.9,99.06 180 top
X61  FFKDS/V1-5.08_MIDDLE  [FFKDS/V1-5,08-1_MIDDLE]  196.81,99.06 180 top
X62  FFKDS/V1-5.08_MIDDLE  [FFKDS/V1-5,08-1_MIDDLE]  191.74,99.06 180 top
X63  FFKDS/V1-5.08_MIDDLE  [FFKDS/V1-5,08-1_MIDDLE]  186.66,99.06 180 top
X64  FFKDS/V1-5.08_MIDDLE  [FFKDS/V1-5,08-1_MIDDLE]  181.57,99.06 180 top
X65  FFKDS/V1-5.08_MIDDLE  [FFKDS/V1-5,08-1_MIDDLE]  176.5,99.06 180 top
X66  FFKDS/V1-5.08_MIDDLE  [FFKDS/V1-5,08-1_MIDDLE]  171.41,99.06 180 top
X67  FFKDS/V1-5.08_MIDDLE  [FFKDS/V1-5,08-1_MIDDLE]  166.34,99.06 180 top
X68  FFKDS/V1-5.08_MIDDLE  [FFKDS/V1-5,08-1_MIDDLE]  161.25,99.06 180 top
X69  FFKDS/V1-5.08_LAST  [FFKDS/V1-5,08-1_LAST]  156.18,99.06 180 top
X70  FFKDS/V1-5.08_FIRST  [FFKDS/V1-5,08-1_FIRST]  212.06,82.55 180 top
X71  FFKDS/V1-5.08_MIDDLE  [FFKDS/V1-5,08-1_MIDDLE]  206.97,82.55 180 top
X72  FFKDS/V1-5.08_MIDDLE  [FFKDS/V1-5,08-1_MIDDLE]  201.9,82.55 180 top
X73  FFKDS/V1-5.08_MIDDLE  [FFKDS/V1-5,08-1_MIDDLE]  196.81,82.55 180 top
X74  FFKDS/V1-5.08_MIDDLE  [FFKDS/V1-5,08-1_MIDDLE]  191.74,82.55 180 top
X75  FFKDS/V1-5.08_MIDDLE  [FFKDS/V1-5,08-1_MIDDLE]  186.66,82.55 180 top
X76  FFKDS/V1-5.08_MIDDLE  [FFKDS/V1-5,08-1_MIDDLE]  181.57,82.55 180 top
X77  FFKDS/V1-5.08_MIDDLE  [FFKDS/V1-5,08-1_MIDDLE]  176.5,82.55 180 top
X78  FFKDS/V1-5.08_MIDDLE  [FFKDS/V1-5,08-1_MIDDLE]  171.41,82.55 180 top
X79  FFKDS/V1-5.08_MIDDLE  [FFKDS/V1-5,08-1_MIDDLE]  166.34,82.55 180 top
X80  FFKDS/V1-5.08_MIDDLE  [FFKDS/V1-5,08-1_MIDDLE]  161.25,82.55 180 top
X81  FFKDS/V1-5.08_LAST  [FFKDS/V1-5,08-1_LAST]  156.18,82.55 180 top
X82  FFKDS/V1-5.08_MIDDLE  [FFKDS/V1-5,08-1_MIDDLE]  113.63,99.06 180 top
X83  FFKDS/V1-5.08_MIDDLE  [FFKDS/V1-5,08-1_MIDDLE]  108.55,99.06 180 top
X84  FFKDS/V1-5.08_MIDDLE  [FFKDS/V1-5,08-1_MIDDLE]  123.79,99.06 180 top
X85  FFKDS/V1-5.08_MIDDLE  [FFKDS/V1-5,08-1_MIDDLE]  118.71,99.06 180 top
X86  FFKDS/V1-5.08_MIDDLE  [FFKDS/V1-5,08-1_MIDDLE]  133.95,99.06 180 top
X87  FFKDS/V1-5.08_MIDDLE  [FFKDS/V1-5,08-1_MIDDLE]  128.87,99.06 180 top
X88  FFKDS/V1-5.08_FIRST  [FFKDS/V1-5,08-1_FIRST]  144.11,99.06 180 top
X89  FFKDS/V1-5.08_MIDDLE  [FFKDS/V1-5,08-1_MIDDLE]  139.03,99.06 180 top
XT1  FFKDS/V1-5.08-2  [FFKDS/V1-5.08-2]  243.21,8.89 0 top
XT2  FFKDS/V1-5.08-2  [FFKDS/V1-5.08-2]  12.7,99.06 180 top
XT3  FFKDS/V1-5.08-2  [FFKDS/V1-5.08-2]  227.33,99.06 180 top
XTAL1  25MHz  [SM49]  15.33,53.59 180 top
XTAL2  MC-306 32.768000kHz 12.5 +20.0-20.0  [MC306]  71.83,55.96 180 top
XTAL3  8MHz  [SM49]  167.22,72.39 0 top